# EAGLE design --XXXX-- (EAGLE 9.6.2)
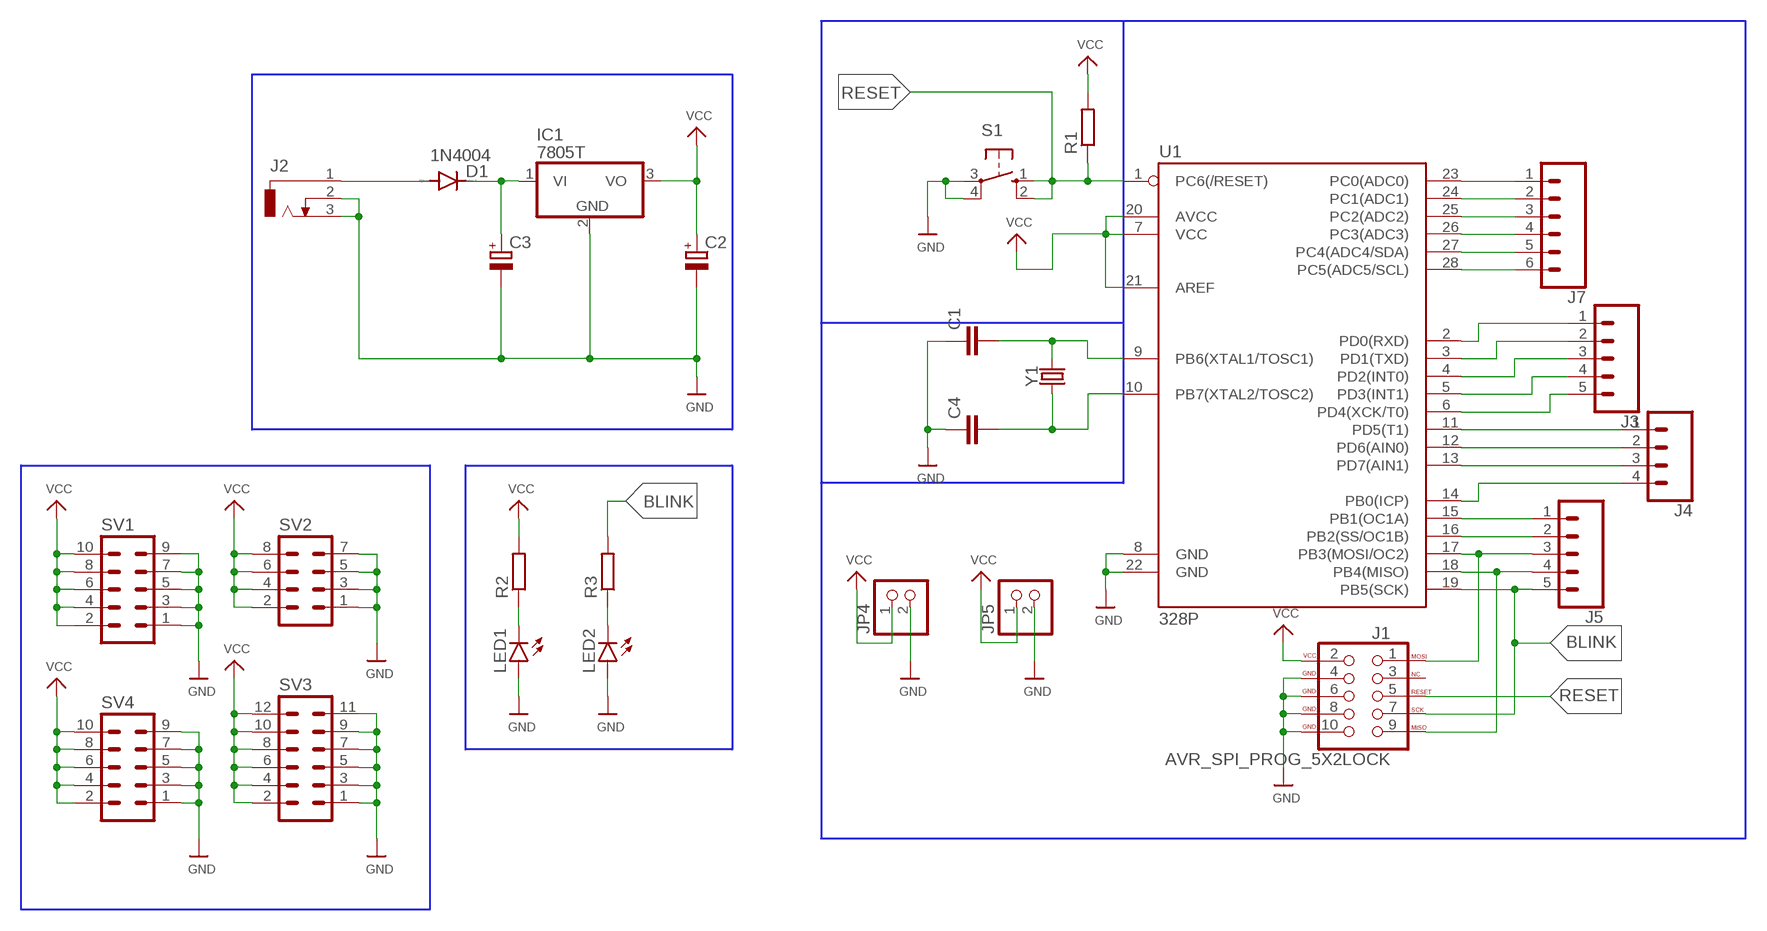
[diagram p0: schematic, sheet 1]

## Parts
C1  C-EU050-024X044  [C050-024X044]
C2  CPOL-EUE2.5-5  [E2,5-5]
C3  CPOL-EUE2.5-7  [E2,5-7]
C4  C-EU050-024X044  [C050-024X044]
D1  1N4004  [DO41-10]
IC1  7805T  [TO220H]
J1  AVR_SPI_PROG_5X2LOCK  [2X5-SHROUDED_LOCK]
J2  DCJ0303  [DCJ0303]
J3  CONN_05  [1X05]
J4  CONN_04  [1X04]
J5  CONN_05  [1X05]
J7  CONN_06SILK_FEMALE_PTH  [1X06]
JP4  PINHD-1X2  [1X02]
JP5  PINHD-1X2  [1X02]
LED1  LED3MM  [LED3MM]
LED2  LED3MM  [LED3MM]
R1  R-EU_0207/10  [0207/10]
R2  R-EU_0207/10  [0207/10]
R3  R-EU_0207/10  [0207/10]
S1  10-XX  [B3F-10XX]
SV1  MA05-2  [MA05-2]
SV2  MA04-2  [MA04-2]
SV3  MA06-2  [MA06-2]
SV4  MA05-2  [MA05-2]
U1  328P  ATMEGA328P_PDIP  [DIP28]
Y1  CRYSTALPTH-HC49UV  [HC49U]

## Nets
BLINK: J1.7(SCK) J5.5 R3.2 U1.19(PB5(SCK))
GND: C1.1 C2.- C3.- C4.1 IC1.2(GND) J1.4(GND) J1.6(GND) J1.8(GND) J1.10(GND) J2.2 J2.3 JP4.2 JP5.2 LED1.A LED2.A S1.3(P) S1.4(P1) SV1.1 SV1.3 SV1.5 SV1.7 SV1.9 SV2.1 SV2.3 SV2.5 SV2.7 SV3.1 SV3.3 SV3.5 SV3.7 SV3.9 SV3.11 SV4.1 SV4.3 SV4.5 SV4.7 SV4.9 U1.8(GND) U1.22(GND)
N$1: J7.1 U1.23(PC0(ADC0))
N$2: J7.2 U1.24(PC1(ADC1))
N$3: J7.3 U1.25(PC2(ADC2))
N$4: J7.4 U1.26(PC3(ADC3))
N$5: J7.5 U1.27(PC4(ADC4/SDA))
N$6: J7.6 U1.28(PC5(ADC5/SCL))
N$7: J3.1 U1.2(PD0(RXD))
N$8: J3.2 U1.3(PD1(TXD))
N$9: J3.3 U1.4(PD2(INT0))
N$10: J3.4 U1.5(PD3(INT1))
N$11: J3.5 U1.6(PD4(XCK/T0))
N$12: J4.1 U1.11(PD5(T1))
N$13: J4.2 U1.12(PD6(AIN0))
N$14: J4.3 U1.13(PD7(AIN1))
N$15: J4.4 U1.14(PB0(ICP))
N$16: J5.1 U1.15(PB1(OC1A))
N$17: J5.2 U1.16(PB2(SS/OC1B))
N$18: J1.1(MOSI) J5.3 U1.17(PB3(MOSI/OC2))
N$19: J1.9(MISO) J5.4 U1.18(PB4(MISO))
N$21: D1.A J2.1
N$22: C1.2 U1.9(PB6(XTAL1/TOSC1)) Y1.2
N$23: C4.2 U1.10(PB7(XTAL2/TOSC2)) Y1.1
N$24: LED1.K(C) R2.1
N$25: C3.+ D1.C IC1.1(VI)
N$26: LED2.K(C) R3.1
RESET: J1.5(RESET) R1.1 S1.1(S) S1.2(S1) U1.1(PC6(/RESET))
VCC: C2.+ IC1.3(VO) J1.2(VCC) JP4.1 JP5.1 R1.2 R2.2 SV1.2 SV1.4 SV1.6 SV1.8 SV1.10 SV2.2 SV2.4 SV2.6 SV2.8 SV3.2 SV3.4 SV3.6 SV3.8 SV3.10 SV3.12 SV4.2 SV4.4 SV4.6 SV4.8 SV4.10 U1.7(VCC) U1.20(AVCC) U1.21(AREF)
Unconnected: J1.3(NC)

## Library data of the parts
C1 C4 = rcl:C-EU: CAPACITOR, European symbol; SPICEPREFIX: C
C2 C3 = rcl:CPOL-EU: POLARIZED CAPACITOR, European symbol; SPICEPREFIX: C
D1 = diode:1N4004: DIODE general purpose rectifier, 1 A
IC1 = linear:78*: Positive VOLTAGE REGULATOR Source: http://cache.national.com/ds/LM/LM78L05.pdf http://www.fairchildsemi.com/ds/LM/LM7805.pdf
J1 = SparkFun-Connectors:AVR_SPI_PROG_5X2: AVR 10-pin ICSP Header This is the standard AVR In Circuit Serial Programming header. Minimal, but includes pin one indicator. Works with standard Olimex programmers. SparkFun Products: 2x5 AVR ICSP Male Header <https://www.sparkfun.com/products/778> - PTH 2x5 Pin Shrouded Header <https://www.sparkfun.com/products/8506> - PTH2; PROD_ID: CONN-08671; SF_ID: PRT-08506
J2 = con-jack:DCJ0303: DC POWER JACK Source: DCJ0303.pdf; OC_FARNELL: unknown; OC_NEWARK: unknown
J3 J5 = SparkFun-Connectors:CONN_05: Multi connection point. Often used as Generic Header-pin footprint for 0.1 inch spaced/style header connections On any of the 0.1 inch spaced packages, you can populate with these: Break Away Headers - Straight <https://www.sparkfun.com/products/116> (PRT-00116) Break Away Male Headers - Right Angle <https://www.sparkfun.com/products/553> (PRT-00553) Female Headers <https://www.sparkfun.com/products/115> (PRT-00115) Break Away Headers - Machine Pin <https://www.sparkfun.com/products/117> (PRT-00117) Break Away Female Headers - Swiss Machine Pin <https://www.sparkfun.com/products/743> (PRT-00743) For SCREWTERMINALS and SPRING TERMINALS visit here: Screw Terimnals on SparkFun.com <https://www.sparkfun.com/search/results?term=Screw+Terminals> (5mm/3.5mm/2.54mm spacing) This device is also useful as a general connection point to wire up your design to another part of your project. Our various solder wires solder well into these plated through hole pads. Hook-Up Wire - Assortment (Stranded, 22 AWG) <https://www.sparkfun.com/products/11375> (PRT-11375) Hook-Up Wire - Assortment (Solid Core, 22 AWG) <https://www.sparkfun.com/products/11367> (PRT-11367) View the entire wire category on our website here <https://www.sparkfun.com/categories/141> Special notes: Molex polarized connector foot print use with SKU : PRT-08231 with associated crimp pins and housings. 1MM SMD Version SKU: PRT-10208
J4 = SparkFun-Connectors:CONN_04: Multi connection point. Often used as Generic Header-pin footprint for 0.1 inch spaced/style header connections On any of the 0.1 inch spaced packages, you can populate with these: Break Away Headers - Straight <https://www.sparkfun.com/products/116> (PRT-00116) Break Away Male Headers - Right Angle <https://www.sparkfun.com/products/553> (PRT-00553) Female Headers <https://www.sparkfun.com/products/115> (PRT-00115) Break Away Headers - Machine Pin <https://www.sparkfun.com/products/117> (PRT-00117) Break Away Female Headers - Swiss Machine Pin <https://www.sparkfun.com/products/743> (PRT-00743) For SCREWTERMINALS and SPRING TERMINALS visit here: Screw Terimnals on SparkFun.com <https://www.sparkfun.com/search/results?term=Screw+Terminals> (5mm/3.5mm/2.54mm spacing) This device is also useful as a general connection point to wire up your design to another part of your project. Our various solder wires solder well into these plated through hole pads. Hook-Up Wire - Assortment (Stranded, 22 AWG) <https://www.sparkfun.com/products/11375> (PRT-11375) Hook-Up Wire - Assortment (Solid Core, 22 AWG) <https://www.sparkfun.com/products/11367> (PRT-11367) View the entire wire category on our website here <https://www.sparkfun.com/categories/141> Special notes: Molex polarized connector foot print use with SKU : PRT-08231 with associated crimp pins and housings. 1MM SMD Version SKU: PRT-10208; PROD_ID: CONN-09696
J7 = SparkFun-Connectors:CONN_06: Multi connection point. Often used as Generic Header-pin footprint for 0.1 inch spaced/style header connections On any of the 0.1 inch spaced packages, you can populate with these: Break Away Headers - Straight <https://www.sparkfun.com/products/116> (PRT-00116) Break Away Male Headers - Right Angle <https://www.sparkfun.com/products/553> (PRT-00553) Female Headers <https://www.sparkfun.com/products/115> (PRT-00115) Break Away Headers - Machine Pin <https://www.sparkfun.com/products/117> (PRT-00117) Break Away Female Headers - Swiss Machine Pin <https://www.sparkfun.com/products/743> (PRT-00743) Arduino Stackable Header - 6 Pin <https://www.sparkfun.com/products/9280> (PRT-09280) For SCREWTERMINALS and SPRING TERMINALS visit here: Screw Terimnals on SparkFun.com <https://www.sparkfun.com/search/results?term=Screw+Terminals> (5mm/3.5mm/2.54mm spacing) This device is also useful as a general connection point to wire up your design to another part of your project. Our various solder wires solder well into these plated through hole pads. Hook-Up Wire - Assortment (Stranded, 22 AWG) <https://www.sparkfun.com/products/11375> (PRT-11375) Hook-Up Wire - Assortment (Solid Core, 22 AWG) <https://www.sparkfun.com/products/11367> (PRT-11367) View the entire wire category on our website here <https://www.sparkfun.com/categories/141>; PROD_ID: CONN-08437
JP4 JP5 = Connector:PINHD-1X2: PIN HEADER; CATEGORY: CONNECTOR; SUB-CATEGORY: PIN-HEADER
LED1 LED2 = led:LED: LED OSRAM: - CHIPLED LG R971, LG N971, LY N971, LG Q971, LY Q971, LO R971, LY R971 LH N974, LH R974 LS Q976, LO Q976, LY Q976 LO Q996 - Hyper CHIPLED LW Q18S LB Q993, LB Q99A, LB R99A - SideLED LS A670, LO A670, LY A670, LG A670, LP A670 LB A673, LV A673, LT A673, LW A673 LH A674 LY A675 LS A676, LA A676, LO A676, LY A676, LW A676 LS A679, LY A679, LG A679 - Hyper Micro SIDELED® LS Y876, LA Y876, LO Y876, LY Y876 LT Y87S - SmartLED LW L88C, LW L88S LB L89C, LB L89S, LG L890 LS L89K, LO L89K, LY L89K LS L896, LA L896, LO L896, LY L896 - TOPLED LS T670, LO T670, LY T670, LG T670, LP T670 LSG T670, LSP T670, LSY T670, LOP T670, LYG T670 LG T671, LOG T671, LSG T671 LB T673, LV T673, LT T673, LW T673 LH T674 LS T676, LA T676, LO T676, LY T676, LB T676, LH T676, LSB T676, LW T676 LB T67C, LV T67C, LT T67C, LS T67K, LO T67K, LY T67K, LW E67C LS E67B, LA E67B, LO E67B, LY E67B, LB E67C, LV E67C, LT E67C LW T67C LS T679, LY T679, LG T679 LS T770, LO T770, LY T770, LG T770, LP T770 LB T773, LV T773, LT T773, LW T773 LH T774 LS E675, LA E675, LY E675, LS T675 LS T776, LA T776, LO T776, LY T776, LB T776 LHGB T686 LT T68C, LB T68C - Hyper Mini TOPLED® LB M676 - Mini TOPLED Santana® LG M470 LS M47K, LO M47K, LY M47K Source: http://www.osram.convergy.de LUXEON: - LUMILED® LXK2-PW12-R00, LXK2-PW12-S00, LXK2-PW14-U00, LXK2-PW14-V00 LXK2-PM12-R00, LXK2-PM12-S00, LXK2-PM14-U00 LXK2-PE12-Q00, LXK2-PE12-R00, LXK2-PE12-S00, LXK2-PE14-T00, LXK2-PE14-U00 LXK2-PB12-K00, LXK2-PB12-L00, LXK2-PB12-M00, LXK2-PB14-N00, LXK2-PB14-P00, LXK2-PB14-Q00 LXK2-PR12-L00, LXK2-PR12-M00, LXK2-PR14-Q00, LXK2-PR14-R00 LXK2-PD12-Q00, LXK2-PD12-R00, LXK2-PD12-S00 LXK2-PH12-R00, LXK2-PH12-S00 LXK2-PL12-P00, LXK2-PL12-Q00, LXK2-PL12-R00 Source: www.luxeon.com KINGBRIGHT: KA-3528ASYC Source: www.kingbright.com
R1-R3 = rcl:R-EU_: RESISTOR, European symbol; SPICEPREFIX: R
S1 = switch-omron:10-XX: OMRON SWITCH; MPN: B3F-1000; OC_FARNELL: 176432; OC_NEWARK: 36M3542
SV1 SV4 = con-lstb:MA05-2: PIN HEADER; OC_FARNELL: unknown; OC_NEWARK: unknown
SV2 = con-lstb:MA04-2: PIN HEADER; OC_FARNELL: unknown; OC_NEWARK: unknown
SV3 = con-lstb:MA06-2: PIN HEADER; OC_FARNELL: unknown; OC_NEWARK: unknown
U1 = SparkFun-IC-Microcontroller:ATMEGA328P_PDIP: Atmel 328P Through hole ATMEGA328P uC used in the Arduino 32kb flash, 1k EEPROM, 2k SRAM Datasheet <http://www.sparkfun.com/datasheets/Components/SMD/ATMega328.pdf> SparkFun Products Storefront component: AVR 28 Pin 20MHz 32K 6A/D - ATMega328P <https://www.sparkfun.com/products/9061> (COM-09061) SparkFun Simon Says - Through-Hole Soldering Kit <https://www.sparkfun.com/products/10547> (KIT-10547) SparkFun Learn to Solder - Simon Says <https://www.sparkfun.com/products/13708> (KIT-13708) SparkFun BigTime Watch Kit <https://www.sparkfun.com/products/11734> (KIT-11734) SparkFun ClockIt <https://www.sparkfun.com/products/10930> (KIT-10930) SparkFun Serial Enabled LCD Kit <https://www.sparkfun.com/products/10097> (LCD-10097) SparkFun Simon Tilts - Through Hole Soldering Kit <https://www.sparkfun.com/products/12634> (KIT-12634) SparkFun Frequency Counter Kit <https://www.sparkfun.com/products/10140> (KIT-10140) FabFM Radio Kit <https://www.sparkfun.com/products/11043> (KIT-11043) SparkFun Binary Blaster Kit <https://www.sparkfun.com/products/12037> (KIT-12037) SparkFun Metro-Gnome <https://www.sparkfun.com/products/9236> (KIT-09236) ATmega328 with Arduino Optiboot (Uno) <https://www.sparkfun.com/products/10524> (DEV-10524); PROD_ID: IC-09136
Y1 = SparkFun-Clocks:CRYSTAL: Crystals (Generic) These are passive quartz crystals, which can be used as a clock source for a microcontroller. Crystal's are two-terminal devices. They require external "load" capacitors to generate an oscillating signal.

## Board
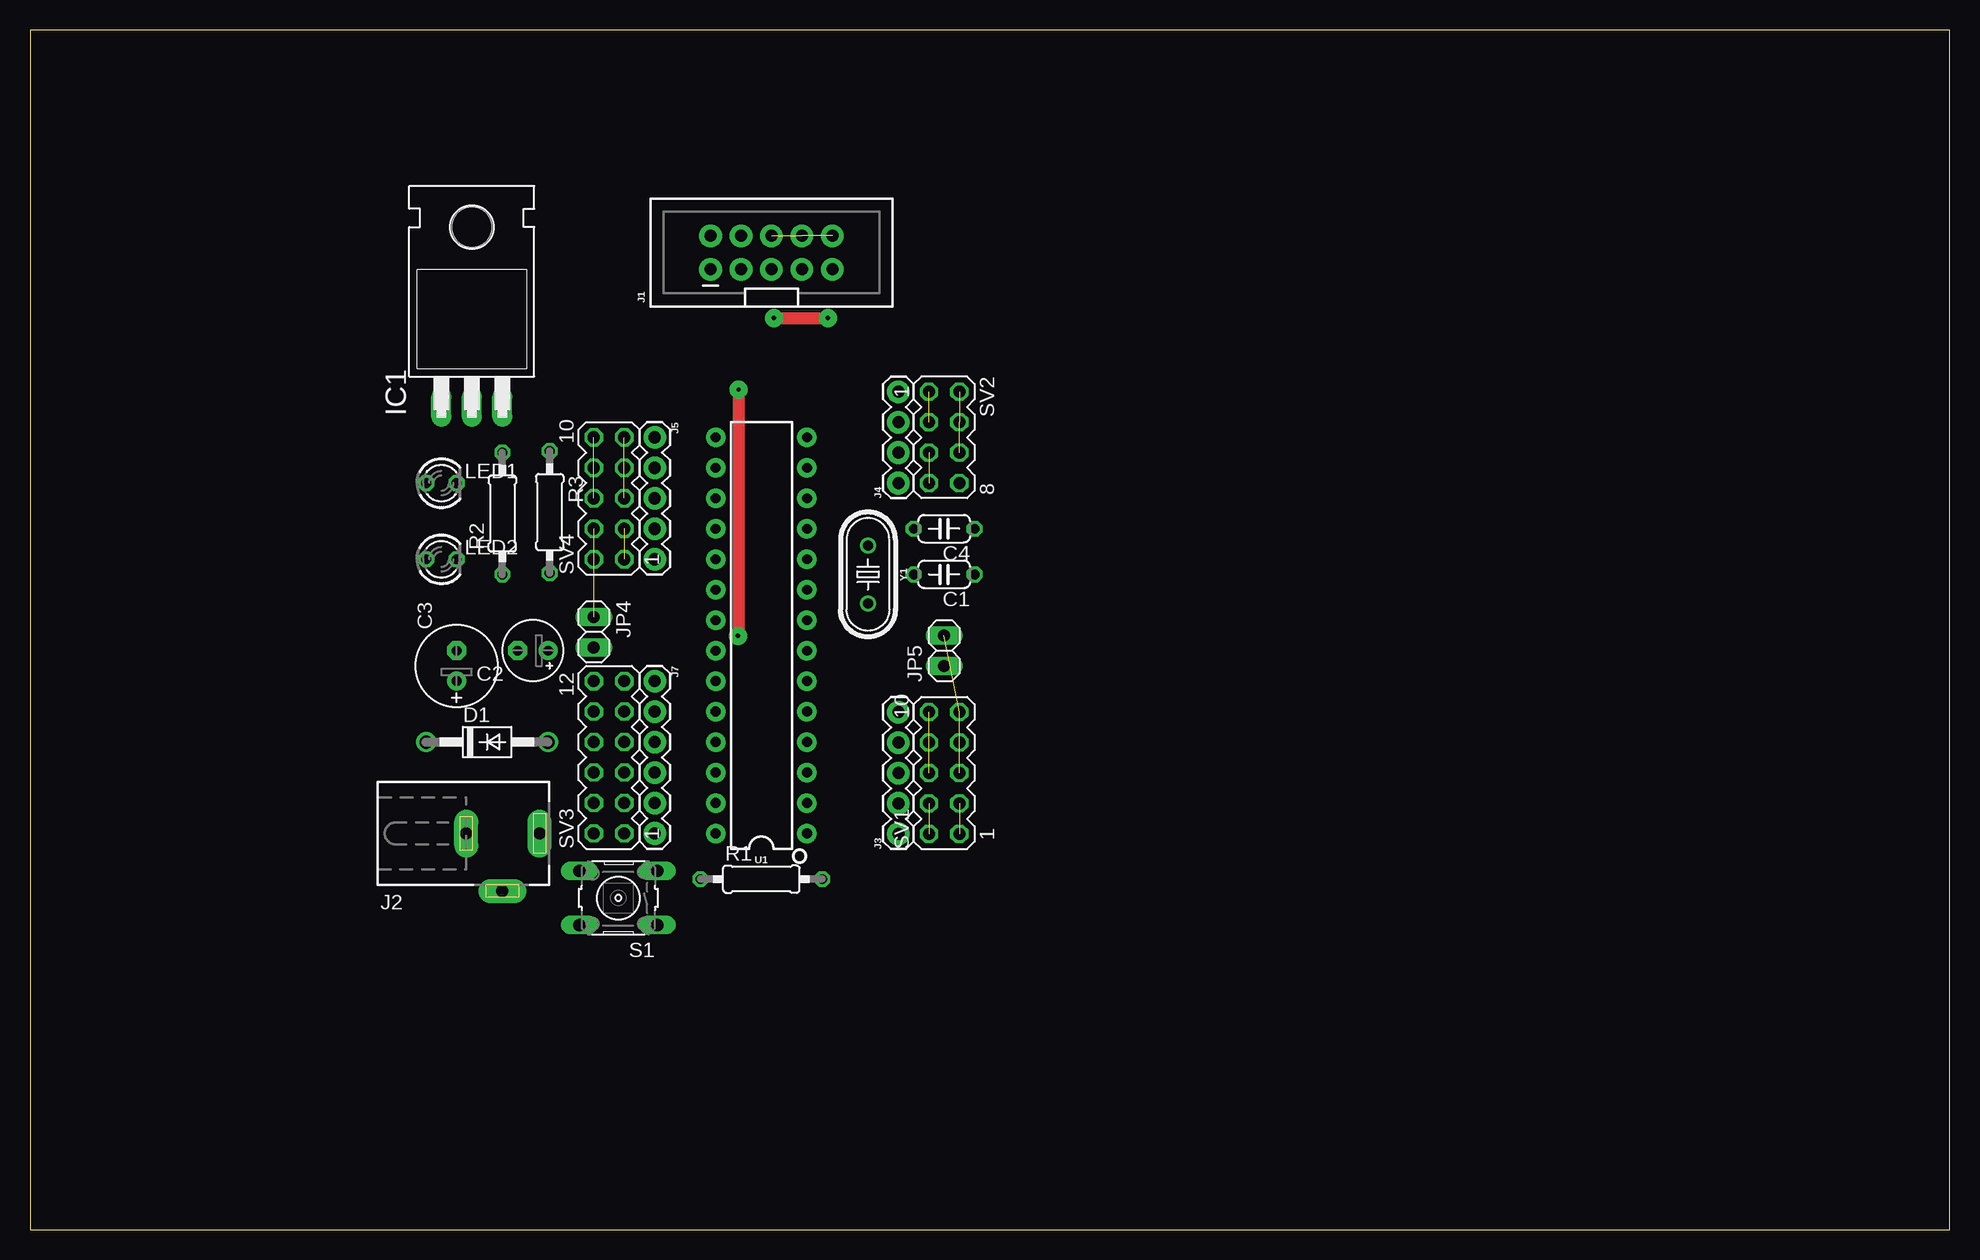
[diagram p1: board, top side]
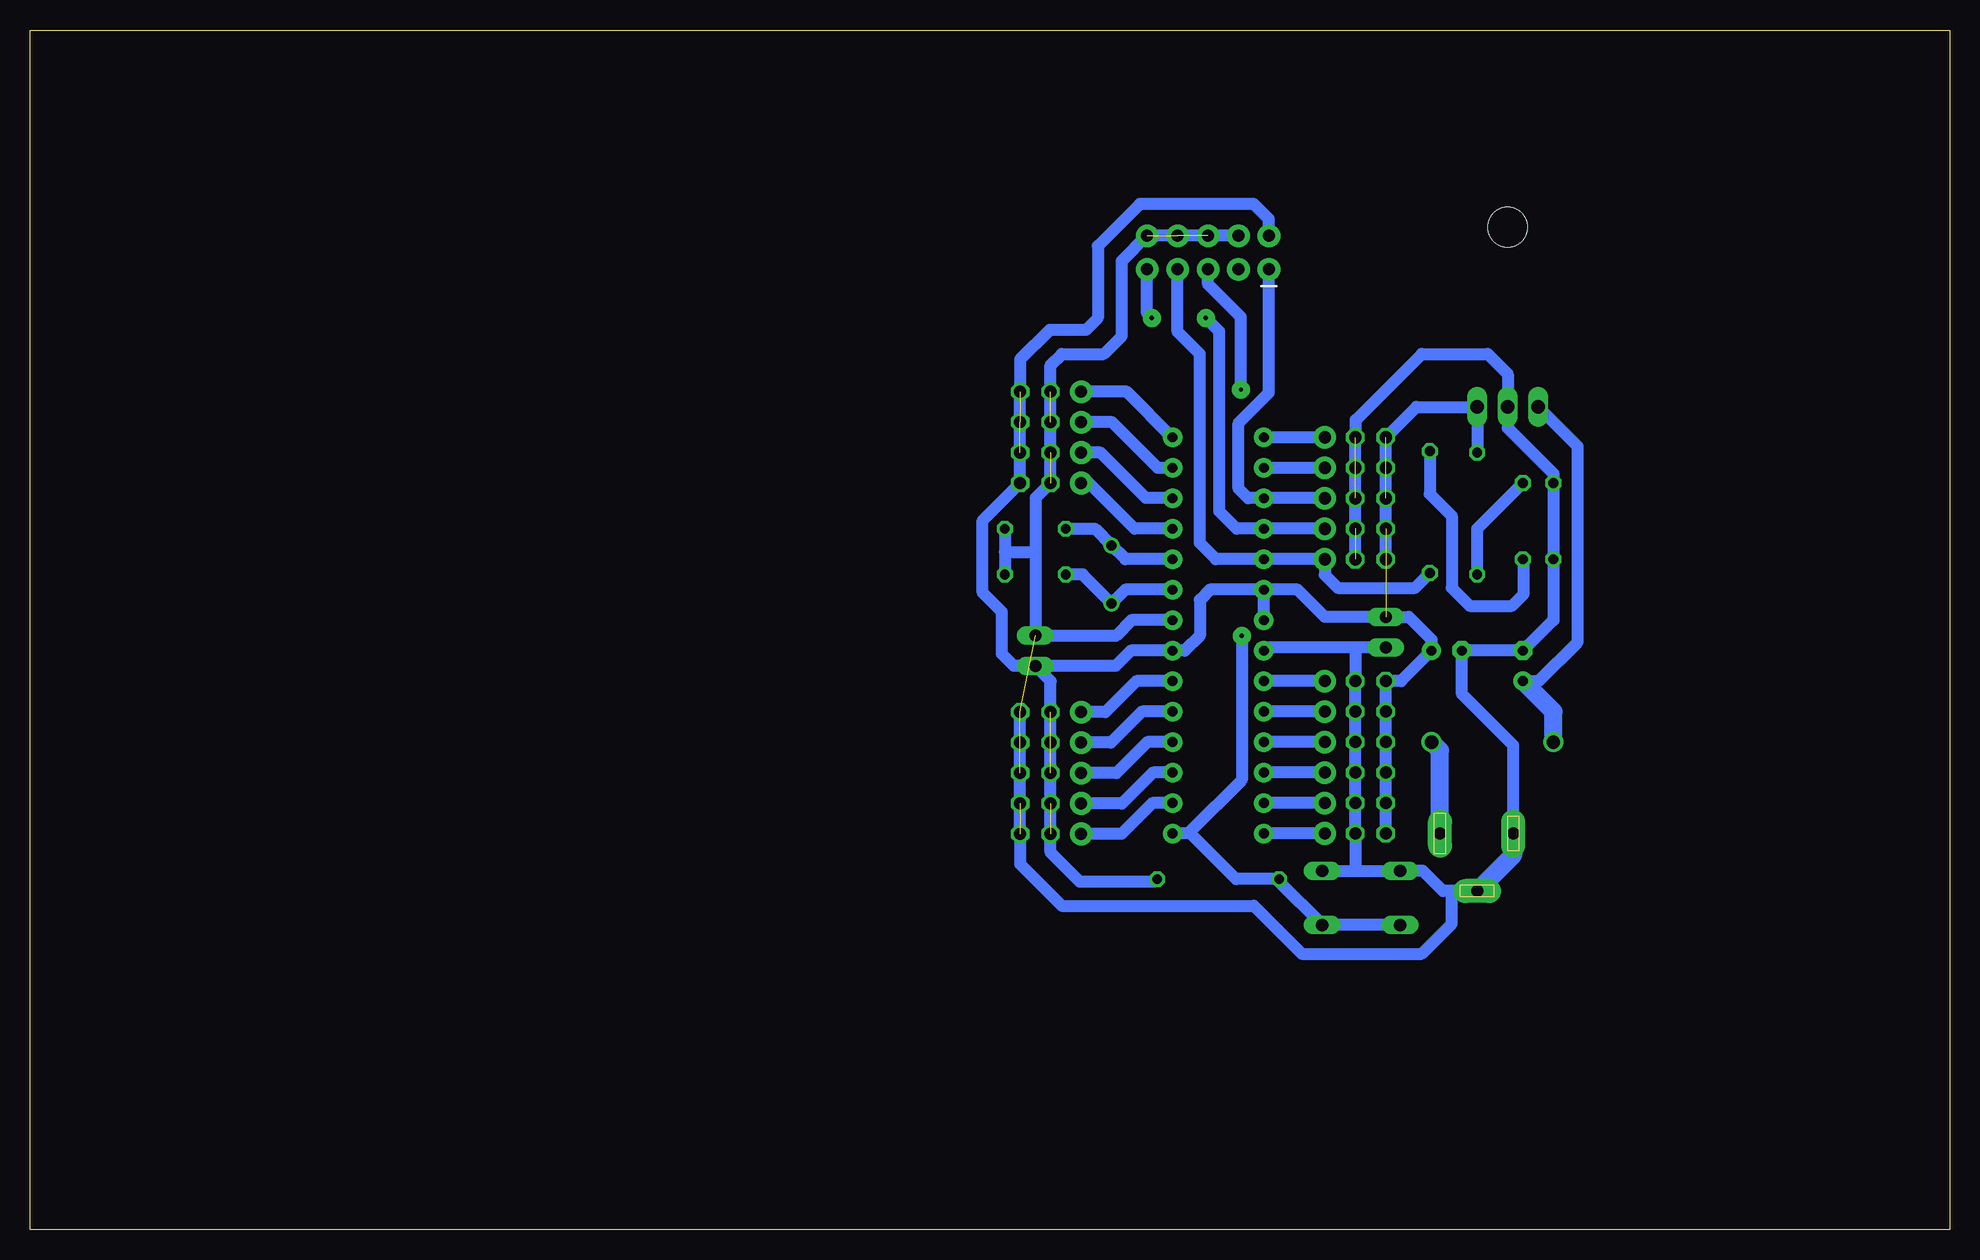
[diagram p2: board, bottom side, seen from below]

Size 160 x 100 mm. Coordinates in mm from the lower left corner, seen from the top.
Outline: 0,0 160,0 160,100 0,100 0,0
Copper layers (1*16): Top 0.035mm / dielectric 1.5mm / Bottom 0.035mm
Design rules "default": minimum track width 6mil, minimum drill 0.35mm, track to track 6mil, track to pad 6mil, pad to pad 6mil, via to via 6mil, smd to smd 6mil, copper to edge 40mil, drill to drill 6mil, minimum pad ring 10mil, minimum via ring 8mil, stop-mask expansion 4mil, vias tented up to drill 0mil, thermal gap 10mil

### Footprints (pad centres in the part's own frame; a part is rotated, then mirrored left to right if it is on the bottom)
C050-024X044 = drill 0.813 octagon: 1 -2.54,0; 2 2.54,0
E2,5-5 = drill 0.813 pad 1.6: + -1.27,0 | drill 0.813 pad 1.6 octagon: - 1.27,0
E2,5-7 = drill 0.813 pad 1.6: + -1.27,0 | drill 0.813 pad 1.6 octagon: - 1.27,0
DO41-10 = drill 1.118: A 5.08,0; C -5.08,0
TO220H = drill 1.118 long: 1 -2.54,-10.16; 2 0,-10.16; 3 2.54,-10.16 | hole 3.302: 0,4.826
2X5-SHROUDED_LOCK = drill 1.016 pad 1.88: 1 -1.397,5.08; 2 1.397,5.08; 3 -1.397,2.54; 4 1.397,2.54; 5 -1.397,0; 6 1.397,0; 7 -1.397,-2.54; 8 1.397,-2.54; 9 -1.397,-5.08; 10 1.397,-5.08
DCJ0303 = drill 1 pad 2 long: 1 0,3.1; 2 4.8,0; 3 0,-3
1X05 = drill 1.016 pad 1.88: 1 0,0; 2 2.54,0; 3 5.08,0; 4 7.62,0; 5 10.16,0
1X04 = drill 1.016 pad 1.88: 1 0,0; 2 2.54,0; 3 5.08,0; 4 7.62,0
1X06 = drill 1.016 pad 1.88: 1 0,0; 2 2.54,0; 3 5.08,0; 4 7.62,0; 5 10.16,0; 6 12.7,0
1X02 = drill 1.016 long: 1 -1.27,0; 2 1.27,0
LED3MM = drill 0.813 octagon: A -1.27,0; K 1.27,0
0207/10 = drill 0.813 octagon: 1 -5.08,0; 2 5.08,0
B3F-10XX = drill 1.016 long: 1 -3.251,2.261; 2 3.251,2.261; 3 -3.251,-2.261; 4 3.251,-2.261
MA05-2 = drill 1.016 octagon: 1 -5.08,-1.27; 2 -5.08,1.27; 3 -2.54,-1.27; 4 -2.54,1.27; 5 0,-1.27; 6 0,1.27; 7 2.54,-1.27; 8 2.54,1.27; 9 5.08,-1.27; 10 5.08,1.27
MA04-2 = drill 1.016 octagon: 1 -3.81,-1.27; 2 -3.81,1.27; 3 -1.27,-1.27; 4 -1.27,1.27; 5 1.27,-1.27; 6 1.27,1.27; 7 3.81,-1.27; 8 3.81,1.27
MA06-2 = drill 1.016 octagon: 1 -6.35,-1.27; 2 -6.35,1.27; 3 -3.81,-1.27; 4 -3.81,1.27; 5 -1.27,-1.27; 6 -1.27,1.27; 7 1.27,-1.27; 8 1.27,1.27; 9 3.81,-1.27; 10 3.81,1.27; 11 6.35,-1.27; 12 6.35,1.27
DIP28 = drill 0.813 pad 1.626: 1 -16.51,-3.81; 2 -13.97,-3.81; 3 -11.43,-3.81; 4 -8.89,-3.81; 5 -6.35,-3.81; 6 -3.81,-3.81; 7 -1.27,-3.81; 8 1.27,-3.81; 9 3.81,-3.81; 10 6.35,-3.81; 11 8.89,-3.81; 12 11.43,-3.81; 13 13.97,-3.81; 14 16.51,-3.81; 15 16.51,3.81; 16 13.97,3.81; 17 11.43,3.81; 18 8.89,3.81; 19 6.35,3.81; 20 3.81,3.81; 21 1.27,3.81; 22 -1.27,3.81; 23 -3.81,3.81; 24 -6.35,3.81; 25 -8.89,3.81; 26 -11.43,3.81; 27 -13.97,3.81; 28 -16.51,3.81
HC49U = drill 0.813: 1 -2.413,0; 2 2.413,0

### Placement (x,y rotation side)
C1  76.2,54.61 180 top
C2  41.91,48.26 180 top
C3  35.56,46.99 90 top
C4  76.2,58.42 180 top
D1  38.1,40.64 0 top
IC1  36.83,78.74 0 top
J1  61.81,81.45 90 top
J2  39.37,33.02 270 top
J3  72.39,32.98 90 top
J4  72.39,62.23 90 top
J5  52.07,66.04 270 top
J7  52.07,45.72 270 top
JP4  46.99,49.8 270 top
JP5  76.2,48.26 90 top
LED1  34.29,62.23 0 top
LED2  34.29,55.88 0 top
R1  60.96,29.21 0 top
R2  39.37,59.69 90 top
R3  43.32,59.81 270 top
S1  49.04,27.64 180 top
SV1  76.2,38.06 90 top
SV2  76.2,66.04 270 top
SV3  48.26,39.37 90 top
SV4  48.26,60.96 90 top
U1  60.96,49.53 90 top
Y1  69.85,54.61 270 top

### Tracks (layer width: path | path; a pad name or v marks a point on that pad's centre or on a via)
BLINK
  Bottom 1: R3.2 44.55,53.5 51,53.5 52.07,54.57 J5.5 U1.19 61.15,55.88 62.5,57.23 62.5,73 64.35,74.85 J1.7
GND  (11 unrouted)
  Bottom 1: C4.1 78.74,56.5 | 78.74,56.5 C1.1 | J2.3 36.37,40.37 40.64,44.64 C2.- C3.- 33.02,50.8 LED2.A LED1.A 33.02,63.02 36.83,66.83 IC1.2 36.83,71.33 38.5,73 44,73 49.5,67.5 49.5,66.07 SV4.9 SV4.1 | JP4.2 49.5,48.53 | 49.5,48.53 56.88,48.53 U1.22 | S1.3 49.5,29.9 | 49.5,29.9 S1.4 43.9,29.9 42.22,28.22 41.5,28.22 | J2.2 41.5,28.22 | 49.5,29.9 49.53,29.93 SV3.1 SV3.3 SV3.5 SV3.7 SV3.9 SV3.11 49.5,45.75 49.5,48.53 | U1.8 68.2,50.8 69.5,49.5 76.17,49.5 | 76.17,49.5 JP5.2 | 76.17,56.5 76.17,60.99 SV2.7 SV2.1 74.93,72.07 74,73 70.5,73 69,74.5 69,80.74 J1.10 J1.4 | 76.17,56.5 76.17,49.5 | 78.74,56.5 76.17,56.5 | SV1.9 SV1.1 77.47,30.47 74,27 58,27 54,23 44,23 41.5,25.5 41.5,28.22
  Bottom 1.5: J2.3 36.37,31.22 J2.2
N$1
  Bottom 1: J7.1 U1.23
N$2
  Bottom 1: J7.2 U1.24
N$3
  Bottom 1: J7.3 U1.25
N$4
  Bottom 1: J7.4 U1.26
N$5
  Bottom 1: J7.5 U1.27
N$6
  Bottom 1: J7.6 U1.28
N$7
  Bottom 1: U1.2 66.44,35.56 69.02,32.98 J3.1
N$8
  Bottom 1: U1.3 66.4,38.1 68.98,35.52 J3.2
N$9
  Bottom 1: U1.4 66.86,40.64 69.44,38.06 J3.3
N$10
  Bottom 1: U1.5 67.32,43.18 69.9,40.6 J3.4
N$11
  Bottom 1: 72.36,43.14 J3.5 70.36,43.14 67.78,45.72 U1.6
N$12
  Bottom 1: U1.11 67.92,58.42 71.73,62.23 J4.1
N$13
  Bottom 1: U1.12 64.81,61 67,61 70.77,64.77 J4.2
N$14
  Bottom 1: U1.13 66,63.5 69.81,67.31 J4.3
N$15
  Bottom 1: U1.14 68.58,69.85 J4.4
N$16
  Bottom 1: J5.1 U1.15
N$17
  Bottom 1: J5.2 U1.16
N$18
  Bottom 1: J5.3 U1.17 58.46,60.96 59.25,61.75 59.25,67.25 56.73,69.77 J1.1
N$19  (via drill 0.35 pad 1.5)
  Top 1: v62,76 v66.5,76
  Bottom 1: J5.4 U1.18 59.42,58.42 60.87,59.87 60.87,74.87 v62,76 | v66.5,76 66.89,76.39 J1.9
N$21
  Bottom 1.5: J2.1 42.47,39.93 D1.A
N$22
  Bottom 1: U1.9 68.71,53.34 Y1.2 72.26,54.61 C1.2
N$23
  Bottom 1: U1.10 68.71,55.88 Y1.1 71.25,58.42 C4.2
N$24
  Bottom 1: R2.1 39.37,58.42 LED1.K
N$25
  Bottom 1: C3.+ 34.28,45.72 31,49 31,65.29 IC1.1
  Bottom 1.5: D1.C 33.02,43.18 C3.+
N$26
  Bottom 1: R3.1 43.32,61.32 41.5,59.5 41.5,53.5 40,52 36.5,52 35.5,53 35.5,55.82 LED2.K
RESET  (via drill 0.35 pad 1.5)
  Top 1: v59.07,70.02 59.07,49.57 v59,49.5
  Bottom 1: S1.2 S1.1 55.88,28.97 R1.1 59.46,29.21 63.27,33.02 | 63.27,33.02 U1.1 | 63.27,33.02 63.27,33.23 59,37.5 v59,49.5 | v59.07,70.02 59.07,76.07 61.81,78.81 J1.5
VCC  (9 unrouted)
  Bottom 1: R2.2 IC1.3 44.45,68.58 SV4.10 SV4.2 | U1.20 U1.21 57.15,53.3 | SV3.2 SV3.4 SV3.6 SV3.8 SV3.10 SV3.12 45.72,45.72 C2.+ 43.18,49.18 45.07,51.07 JP4.1 52.07,51.07 54.34,53.34 U1.20 | R1.2 66.25,29 72.5,29 74.93,31.43 SV1.2 SV1.10 74.93,45.72 JP5.1 | JP5.1 69.51,46.99 68.24,48.26 U1.7 63.74,48.26 62.5,49.5 62.5,52.5 61.66,53.34 U1.20 | J1.2 56.73,84.23 58,85.5 67.5,85.5 71,82 71,76 72,75 75,75 77.47,72.53 SV2.2 SV2.8 80.6,59.1 80.6,53.1 79,51.5 79,48 77.99,46.99 JP5.1